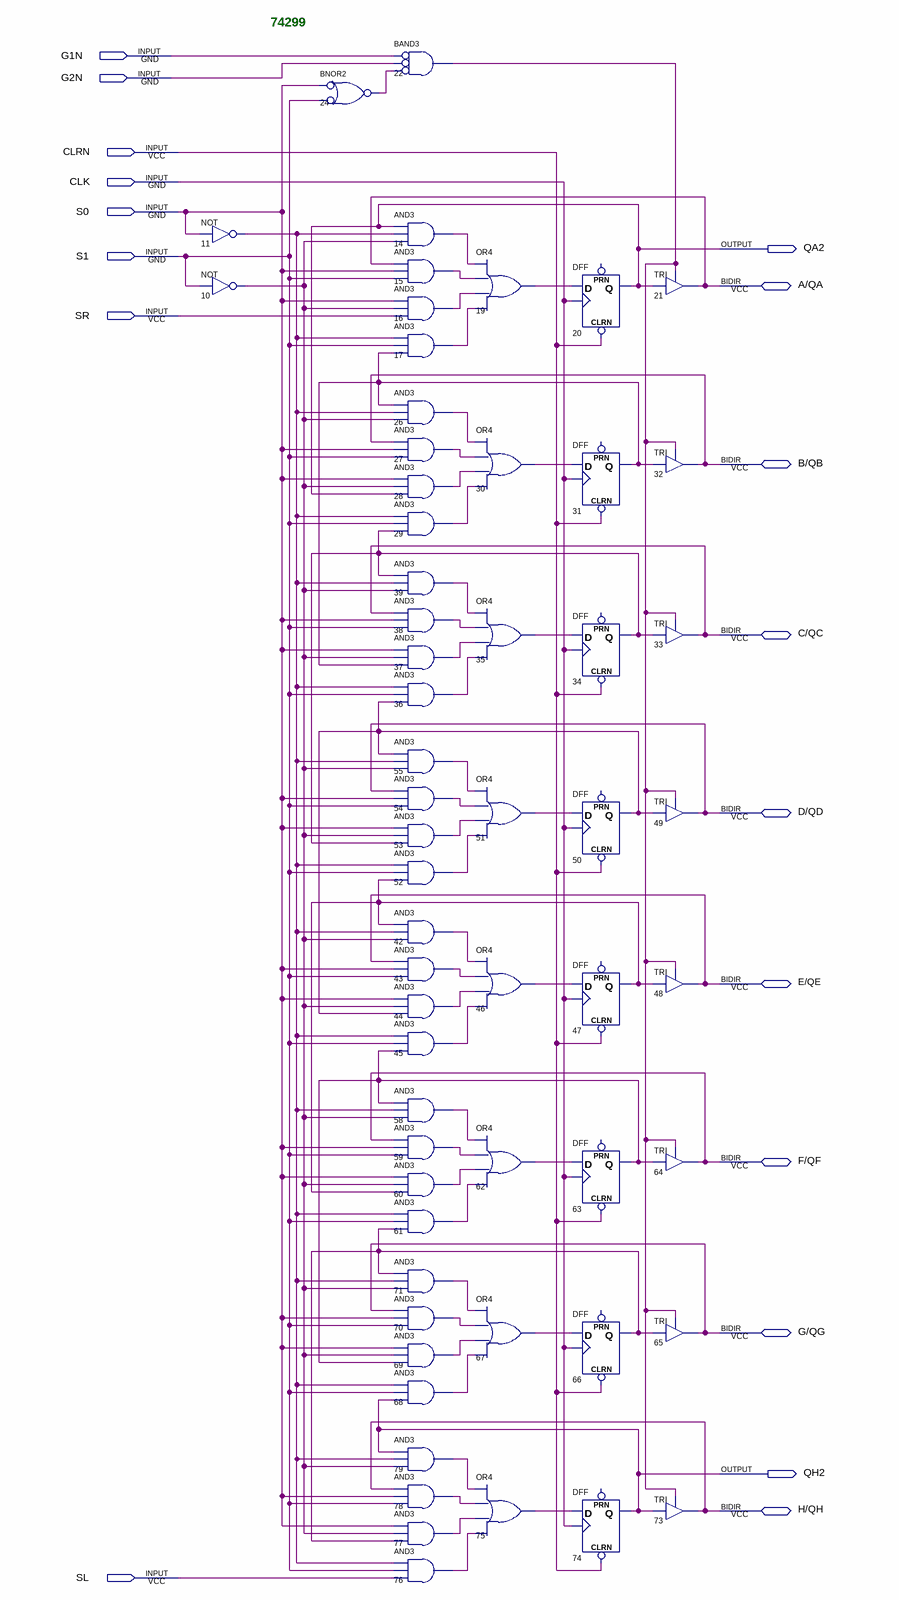
[diagram p0: schematic sheet]
// Quartus schematic 74299.bdf as structural Verilog: 60 symbols, 18 pins
module \74299  (
  input  G1N,
  input  G2N,
  input  CLRN,
  input  CLK,
  input  S0,
  input  S1,
  input  SR,
  input  SL,
  inout  \A/QA ,
  inout  \B/QB ,
  inout  \C/QC ,
  inout  \D/QD ,
  inout  \E/QE ,
  inout  \F/QF ,
  inout  \G/QG ,
  inout  \H/QH ,
  output QA2,
  output QH2
);

  wire n10_out, n11_out, n14_out, n15_out, n16_out, n17_out, n19_out, n22_out, n24_out, n26_out, n27_out,
       n28_out, n29_out, n30_out, n31_q, n34_q, n35_out, n36_out, n37_out, n38_out, n39_out, n42_out,
       n43_out, n44_out, n45_out, n46_out, n47_q, n50_q, n51_out, n52_out, n53_out, n54_out, n55_out,
       n58_out, n59_out, n60_out, n61_out, n62_out, n63_q, n66_q, n67_out, n68_out, n69_out, n70_out,
       n71_out, n75_out, n76_out, n77_out, n78_out, n79_out;

  not u_11 (n11_out, S0);
  not u_10 (n10_out, S1);
  nor u_24 (n24_out, ~S0, ~S1);  // BNOR2
  and u_22 (n22_out, ~G1N, ~G2N, ~n24_out);  // BAND3
  and u_14 (n14_out, QA2, n11_out, n10_out);
  and u_15 (n15_out, \A/QA , S0, S1);
  and u_16 (n16_out, S0, n10_out, SR);
  and u_17 (n17_out, n11_out, S1, n31_q);
  and u_26 (n26_out, n31_q, n11_out, n10_out);
  and u_27 (n27_out, \B/QB , S0, S1);
  and u_28 (n28_out, S0, n10_out, QA2);
  and u_29 (n29_out, n11_out, S1, n34_q);
  and u_39 (n39_out, n34_q, n11_out, n10_out);
  and u_38 (n38_out, \C/QC , S0, S1);
  and u_37 (n37_out, S0, n10_out, n31_q);
  and u_36 (n36_out, n11_out, S1, n50_q);
  and u_55 (n55_out, n50_q, n11_out, n10_out);
  and u_54 (n54_out, \D/QD , S0, S1);
  and u_53 (n53_out, S0, n10_out, n34_q);
  and u_52 (n52_out, n11_out, S1, n47_q);
  and u_42 (n42_out, n47_q, n11_out, n10_out);
  and u_43 (n43_out, \E/QE , S0, S1);
  and u_44 (n44_out, S0, n10_out, n50_q);
  and u_45 (n45_out, n11_out, S1, n63_q);
  and u_58 (n58_out, n63_q, n11_out, n10_out);
  and u_59 (n59_out, \F/QF , S0, S1);
  and u_60 (n60_out, S0, n10_out, n47_q);
  and u_61 (n61_out, n11_out, S1, n66_q);
  and u_71 (n71_out, n66_q, n11_out, n10_out);
  and u_70 (n70_out, \G/QG , S0, S1);
  and u_69 (n69_out, S0, n10_out, n63_q);
  and u_68 (n68_out, n11_out, S1, QH2);
  and u_79 (n79_out, QH2, n11_out, n10_out);
  and u_78 (n78_out, \H/QH , S0, S1);
  and u_77 (n77_out, S0, n10_out, n66_q);
  and u_76 (n76_out, n11_out, S1, SL);
  or u_19 (n19_out, n14_out, n15_out, n16_out, n17_out);
  or u_30 (n30_out, n26_out, n27_out, n28_out, n29_out);
  or u_35 (n35_out, n39_out, n38_out, n37_out, n36_out);
  or u_51 (n51_out, n55_out, n54_out, n53_out, n52_out);
  or u_46 (n46_out, n42_out, n43_out, n44_out, n45_out);
  or u_62 (n62_out, n58_out, n59_out, n60_out, n61_out);
  or u_67 (n67_out, n71_out, n70_out, n69_out, n68_out);
  or u_75 (n75_out, n79_out, n78_out, n77_out, n76_out);
  DFF u_20 (.CLRN(CLRN), .CLK(CLK), .D(n19_out), .Q(QA2));  // open: PRN
  DFF u_31 (.CLRN(CLRN), .CLK(CLK), .D(n30_out), .Q(n31_q));  // open: PRN
  DFF u_34 (.CLRN(CLRN), .CLK(CLK), .D(n35_out), .Q(n34_q));  // open: PRN
  DFF u_50 (.CLRN(CLRN), .CLK(CLK), .D(n51_out), .Q(n50_q));  // open: PRN
  DFF u_47 (.CLRN(CLRN), .CLK(CLK), .D(n46_out), .Q(n47_q));  // open: PRN
  DFF u_63 (.CLRN(CLRN), .CLK(CLK), .D(n62_out), .Q(n63_q));  // open: PRN
  DFF u_66 (.CLRN(CLRN), .CLK(CLK), .D(n67_out), .Q(n66_q));  // open: PRN
  DFF u_74 (.CLRN(CLRN), .CLK(CLK), .D(n75_out), .Q(QH2));  // open: PRN
  TRI u_21 (.IN(QA2), .OE(n22_out), .OUT(\A/QA ));
  TRI u_32 (.IN(n31_q), .OE(n22_out), .OUT(\B/QB ));
  TRI u_33 (.IN(n34_q), .OE(n22_out), .OUT(\C/QC ));
  TRI u_49 (.IN(n50_q), .OE(n22_out), .OUT(\D/QD ));
  TRI u_48 (.IN(n47_q), .OE(n22_out), .OUT(\E/QE ));
  TRI u_64 (.IN(n63_q), .OE(n22_out), .OUT(\F/QF ));
  TRI u_65 (.IN(n66_q), .OE(n22_out), .OUT(\G/QG ));
  TRI u_73 (.IN(QH2), .OE(n22_out), .OUT(\H/QH ));

  // Notes on the sheet:
  //   74299
endmodule
